# Altium schematic sheet Apollo_3.SchDoc
size A4
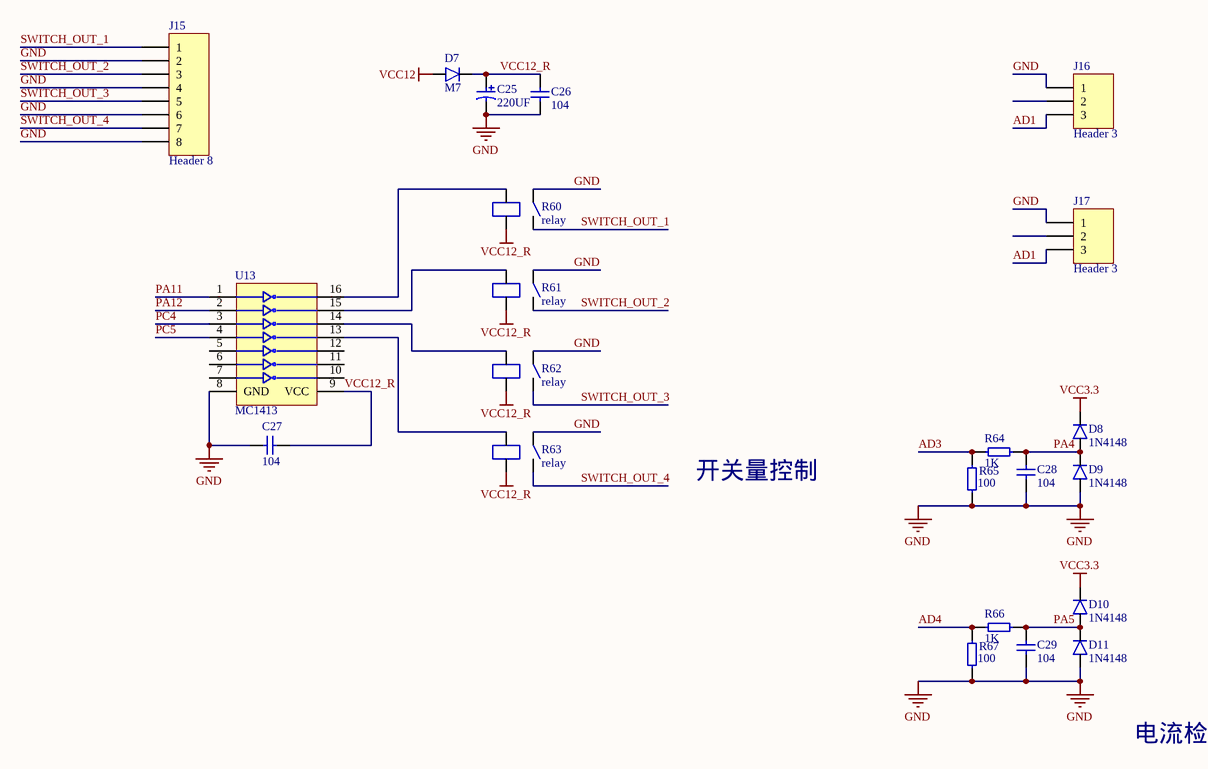
[diagram p0: Apollo_3.SchDoc]

## Parts
C25  220UF  [RB 2.5/6.3]
C26  104  [0805C]
C27  104  [0805C]
C28  104  [0805C]
C29  104  [0805C]
D7  M7  [SMA (DO-214AC)]
D8  1N4148  [SOD 323]
D9  1N4148  [SOD 323]
D10  1N4148  [SOD 323]
D11  1N4148  [SOD 323]
J15  Header 8  [2EDG 8-3.80]
J16  Header 3  [3EDG 3-5.08]
J17  Header 3  [3EDG 3-3.80]
R60  relay  [HF49FD/012-1H11]
R61  relay  [HF49FD/012-1H11]
R62  relay  [HF49FD/012-1H11]
R63  relay  [HF49FD/012-1H11]
R64  1K  [0805]
R65  100  [0805]
R66  1K  [0805]
R67  100  [0805]
U13  MC1413  [SOP 16-1.27/3.9]

## Nets
GND: C25.1 C26.1 C27.1 C28.1 C29.1 D9.2(+) D11.2(+) J15.2 J15.4 J15.6 J15.8 J16.1 J17.1 R60.3 R61.3 R62.3 R63.3 R65.1 R67.1 U13.8(GND)
VCC3.3: D8.1(-) D10.1(-)
VCC12: D7.2(+)
VCC12_R: C25.2 C26.2 C27.2 D7.1(-) R60.2 R61.2 R62.2 R63.2 U13.9(VCC)
AD1: J16.3 J17.3
AD3: R64.2 R65.2
AD4: R66.2 R67.2
PA4: C28.2 D8.2(+) D9.1(-) R64.1
PA5: C29.2 D10.2(+) D11.1(-) R66.1
PA11: U13.1
PA12: U13.2
PC4: U13.3
PC5: U13.4
SWITCH_OUT_1: J15.1 R60.4
SWITCH_OUT_2: J15.3 R61.4
SWITCH_OUT_3: J15.5 R62.4
SWITCH_OUT_4: J15.7 R63.4
NetR60_1: R60.1 U13.16
NetR61_1: R61.1 U13.15
NetR62_1: R62.1 U13.14
NetR63_1: R63.1 U13.13

Not connected (* = marked no-connect by the designer): J16 2; J17 2; U13 5 6 7 10 11 12

## Notes on the sheet
- Labels drawn without touching a wire or pin: 开关量控制, 电流检测

## Library data of the parts
C25 = CAP-POL2
C26-C29 = CAP
J15 = Header 8: Header, 8-Pin; LatestRevisionDate: 17-Jul-2002; LatestRevisionNote: Re-released for DXP Platform.; Publisher: Altium Limited
J16 J17 = Header 3: Header, 3-Pin; LatestRevisionDate: 17-Jul-2002; LatestRevisionNote: Re-released for DXP Platform.; Publisher: Altium Limited
R64-R67 = RES